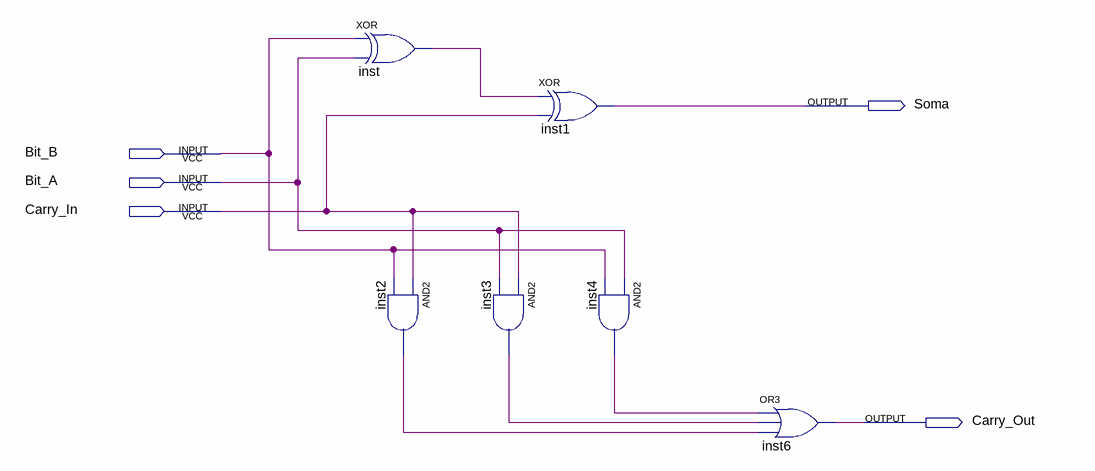
[diagram p0: schematic sheet]
// Quartus schematic SOMADOR1bt.bdf as structural Verilog: 6 symbols, 5 pins
module SOMADOR1bt (
  input  Bit_B,
  input  Bit_A,
  input  Carry_In,
  output Soma,
  output Carry_Out
);

  wire inst2_out, inst3_out, inst4_out, inst_out;

  xor inst (inst_out, Bit_B, Bit_A);
  and inst2 (inst2_out, Carry_In, Bit_B);
  and inst3 (inst3_out, Carry_In, Bit_A);
  xor inst1 (Soma, inst_out, Carry_In);
  and inst4 (inst4_out, Bit_A, Bit_B);
  or inst6 (Carry_Out, inst4_out, inst3_out, inst2_out);
endmodule
